# Altium schematic sheet Gate_Driver.SchDoc
size A4; SheetNumber: 2; SheetTotal: 9; SPICEModelCacheSDNXEFHK: <root> / <DocumentId>SDNXEFHK</DocumentId> / <CacheFrame Number="0"> / <Model Name="jmk325ac6107_m-p" Kind="CKT"> / <Text>* JMK325AC6107_M-P     SPICE MODEL  ( General Type ) / *-------------------------------------------------------------------------------------------------------- / * Model Generated by TAIYO YUDEN Corporation (http://www.ty-top.com) / * Version 1.0 / * TAIYO YUDEN Control No. 180521 / *-------------------------------------------------------------------------------------------------------- / * / * Products Name : Multilayer Ceramic Capacitors / * / * Characteristics : / *     Capacitance : 100 uF , Rated Voltage : 6.3V , TCC : X6S / *     Case Size : 3.2 x 2.5 / 0.126 x 0.098 [mm/inch] , Thickness : 2.5 / 0.098 [mm/inch] / *     (Conditions: Temperature = 25 degC , DC Bias Current/Voltage = 0A / 0V) / * / * Frequency Range : 0.0001MHz - 3000MHz / * / * External Node Assignments : / * / *  1  o---| |---o  2 / * / *-------------------------------------------------------------------------------------------------------- / .SubCkt JMK325AC6107_M-P 1 2 / **************************** / C0 1 110 84.041u / Cm 1 101 6.4542u / C1 101 102 23.925u / Rc1 101 102 26.91 / C2 102 103 22.738u / Rc2 102 103 11.611 / C3 103 110 14.771u / Rc3 103 110 1.1701 / C2m 1 301 2.8348u / C21 301 302 86.426u / Rc21 301 302 122.56 / C22 302 303 42.078u / Rc22 302 303 54.419 / C23 303 304 18.473u / Rc23 303 304 45.467 / C24 304 305 15.24u / Rc24 304 305 25.43 / C25 305 306 12.218u / Rc25 305 306 14.511 / C26 306 307 8.9602u / Rc26 306 307 7.3048 / C27 307 308 6.4396u / Rc27 307 308 4.0856 / C28 308 309 3.5418u / Rc28 308 309 2.2851 / C29 309 110 1.4287u / Rc29 309 110 1.8837 / Rp0 1 110 1Meg / L0 110 120 0.1837n / Lm 120 130 0.44285n / L1 120 121 0.3007n / RL1 121 130 0.18029 / L2 120 122 0.60464n / RL2 122 130 69.963m / L3 120 123 0.74938n / RL3 123 130 2.1757 / CR 120 124 19.095u / LR 124 125 0.53061n / RR 125 130 10.898m / CL 130 140 8.9181p / LL 130 140 0.18335n / RL 130 140 6.5197 / Rs 140 2 1.3136m / **************************** / .ends</Text> / </Model> / </CacheFrame> / </root>
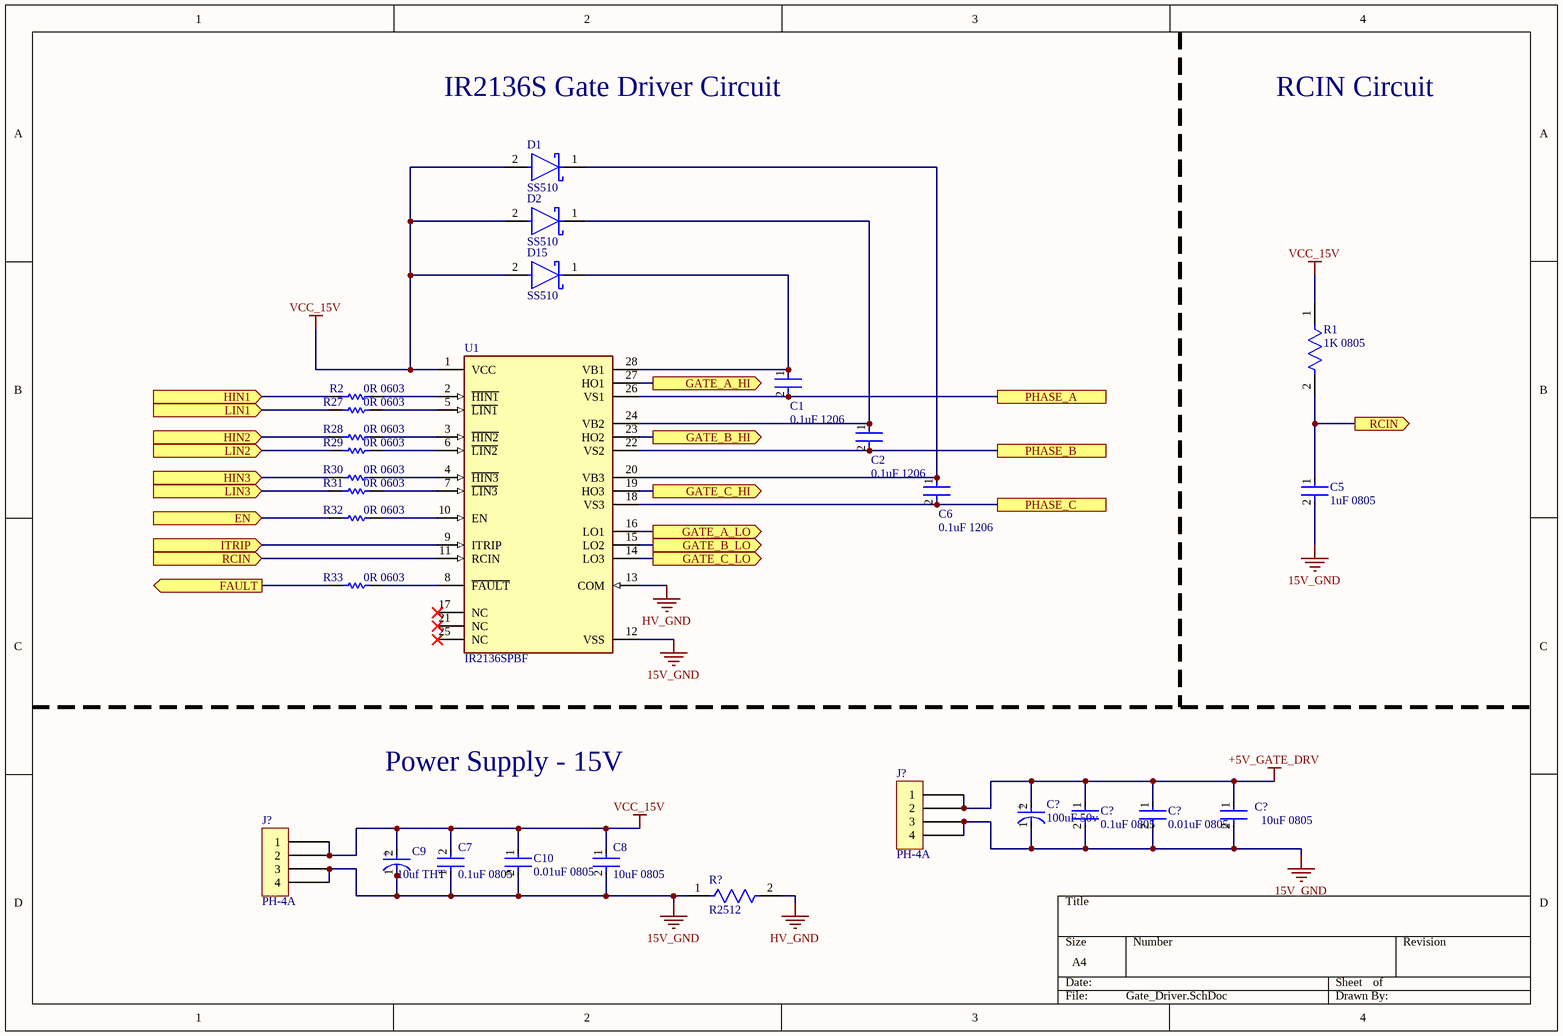
[diagram p0: Gate_Driver.SchDoc]

## Parts
(Parts that share a designator on the sheet are numbered #1, #2 ... from top to bottom, then left to right.)
C1  0.1uF 1206  [C1206]
C2  0.1uF 1206  [C1206]
C5  1uF 0805  [R0805]
C6  0.1uF 1206  [C1206]
C7  0.1uF 0805  [R0805]
C8  10uF 0805  [R0805]
C9  10uf THT  [FP-RAD-TH-D_10_0_5-L_20_2-MFG]
C10  0.01uF 0805  [R0805]
C?#1  100uF 50v  [FP-EEU-FR1H101B-MFG]
C?#2  0.1uF 0805  [R0805]
C?#3  0.01uF 0805  [R0805]
C?#4  10uF 0805  [R0805]
D1  SS510  [DO-210AA]
D2  SS510  [DO-210AA]
D15  SS510  [DO-210AA]
J?#1  PH-4A  [JST PH-4A]
J?#2  PH-4A  [JST PH-4A]
R1  1K 0805  [R0805]
R2  0R 0603  [R0603]
R27  0R 0603  [R0603]
R28  0R 0603  [R0603]
R29  0R 0603  [R0603]
R30  0R 0603  [R0603]
R31  0R 0603  [R0603]
R32  0R 0603  [R0603]
R33  0R 0603  [R0603]
R?  R2512  [R2512]
U1  IR2136SPBF  [FP-PG-DSO-28-IPC_C]

## Ports
EN (in), FAULT (out), GATE_A_HI (out), GATE_A_LO (out), GATE_B_HI (out), GATE_B_LO (out), GATE_C_HI (out), GATE_C_LO (out), HIN1 (in), HIN2 (in), HIN3 (in), ITRIP (in), LIN1 (in), LIN2 (in), LIN3 (in), PHASE_A, PHASE_B, PHASE_C, RCIN (in), RCIN (out)

## Nets
15V_GND: C5.2 C7.1 C8.2 C9.1(C) C10.2 C?#1.1(C) C?#2.2 C?#3.2 C?#4.2 J?#1.3 J?#1.4 J?#2.3 J?#2.4 R?.1 U1.12(VSS)
+5V_GATE_DRV: C?#1.2(A) C?#2.1 C?#3.1 C?#4.1 J?#1.1 J?#1.2
HV_GND: R?.2 U1.13(COM)
VCC_15V: C7.2 C8.1 C9.2(A) C10.1 D1.2(A) D2.2(A) D15.2(A) J?#2.1 J?#2.2 R1.1 U1.1(VCC)
EN: R32.1 ; port EN
FAULT: R33.1 ; port FAULT
GATE_A_HI: U1.27(HO1) ; port GATE_A_HI
GATE_A_LO: U1.16(LO1) ; port GATE_A_LO
GATE_B_HI: U1.23(HO2) ; port GATE_B_HI
GATE_B_LO: U1.15(LO2) ; port GATE_B_LO
GATE_C_HI: U1.19(HO3) ; port GATE_C_HI
GATE_C_LO: U1.14(LO3) ; port GATE_C_LO
HIN1: R2.1 ; port HIN1
HIN2: R28.1 ; port HIN2
HIN3: R30.1 ; port HIN3
ITRIP: U1.9(ITRIP) ; port ITRIP
LIN1: R27.1 ; port LIN1
LIN2: R29.1 ; port LIN2
LIN3: R31.1 ; port LIN3
PHASE_A: C1.2 U1.26(VS1) ; port PHASE_A
PHASE_B: C2.2 U1.22(VS2) ; port PHASE_B
PHASE_C: C6.2 U1.18(VS3) ; port PHASE_C
RCIN: C5.1 R1.2 U1.11(RCIN) ; port RCIN
NetC1_1: C1.1 D15.1(C) U1.28(VB1)
NetC2_1: C2.1 D2.1(C) U1.24(VB2)
NetC6_1: C6.1 D1.1(C) U1.20(VB3)
NetR2_2: R2.2 U1.2(~{HIN1})
NetR27_2: R27.2 U1.5(~{LIN1})
NetR28_2: R28.2 U1.3(~{HIN2})
NetR29_2: R29.2 U1.6(~{LIN2})
NetR30_2: R30.2 U1.4(~{HIN3})
NetR31_2: R31.2 U1.7(~{LIN3})
NetR32_2: R32.2 U1.10(EN)
NetR33_2: R33.2 U1.8(~{FAULT})

Not connected (* = marked no-connect by the designer): U1 17(NC)* 21(NC)* 25(NC)*

## Notes on the sheet
- IR2136S Gate Driver Circuit
- RCIN Circuit
- Power Supply - 15V
- (in symbol CMP-05427-000020-1) +
- (in symbol CMP-05427-000384-1) +

## Library data of the parts
C1 C2 C6 = 0.1uF 1206: 0.1uF/100nF 50V Capacitor ±10% Tolerance CC1206KRX7R9BB104 – 1206 Package; Price per piece: 2.22; Product URL: https://sharvielectronics.com/product/0-1uf-100nf-50v-capacitor-%c2%b110-tolerance-cc1206krx7r9bb104-1206-package/; Datasheet: https://sharvielectronics.com/wp-content/uploads/2020/09/Yageo-smd-Capacitor.pdf
C5 = 1uF 0805: 1uF/1000nF 50V Capacitor ±10% Tolerance CC0805KKX7R9BB105 – 0805 Package; Price per piece: 2.16; Product URL: https://sharvielectronics.com/product/1uf-1000nf-50v-capacitor-%c2%b110-tolerance-cc0805kkx7r9bb105-0805-package/; Datasheet: https://drive.google.com/file/d/1wr2K_YaGqgMtACeU2pC6RWLSxDMrIPxr/view?usp=sharing
C7 C?#2 = 0.1uF 0805: 0.1uF/100nF 100V Capacitor ±10% Tolerance CC0805KKX7R0BB104 – 0805 Package; Product URL: https://sharvielectronics.com/product/0-1uf-100nf-100v-capacitor-%c2%b110-tolerance-cc0805kkx7r0bb104-0805-package/; Price per piece: 4.76; Datasheet: https://drive.google.com/file/d/1wr2K_YaGqgMtACeU2pC6RWLSxDMrIPxr/view?usp=sharing
C8 C?#4 = 10uF 0805: 10uF/1000nF 50V Capacitor ±10% Tolerance CC0805KKX5R9BB106 – 0805 Package; Product URL: https://sharvielectronics.com/product/10uf-1000nf-50v-capacitor-%c2%b110-tolerance-cc0805kkx5r9bb106-0805-package/; Price per piece: 2.85; Datasheet: https://drive.google.com/file/d/1wr2K_YaGqgMtACeU2pC6RWLSxDMrIPxr/view?usp=sharing
C9 = CMP-05427-000384-1: Aluminum Electrolytic Capacitors (Radial Lead Type) 10uF ±20% 350V; Lead/Base Style: Straight; Lead Diameter: 0.6mm; Ripple Current (AC): 82mA; Life (Hours): 2000Hour; Series: NHG; Packaging: Bulk; Case/Package: Radial; Contact Plating: Tin; Voltage Rating: 350V; Tolerance: 20%; Termination: Radial; Lead Pitch: 5mm; Max Operating Temperature: 105°C; REACH SVHC: No SVHC; Height - Seated (Max): 0.866inch; Radiation Hardening: No; Voltage Rating (DC): 350V; Diameter: 10mm; Length: 20mm; Mount: Through Hole; Package Quantity: 200; Min Operating Temperature: -25°C; Construction: RADIAL; Ripple Current: 82mA; Height: 20mm; Capacitance: 10uF; RoHS Compliant: Yes; Price per piece: 2.25; Product URL: https://sharvielectronics.com/product/10uf-35v-electrolytic-capacitor-105c-5x11mm-samwha/; Datasheet: https://drive.google.com/file/d/1s8SUY3P6K0bBIcG8WC2zo0Wz7jUZ4bD_/view?usp=sharing
C10 C?#3 = 0.01uF 0805: 10nF/0.01uF 50V Capacitor ±10% Tolerance 0805B103K500CT – 0805 Package; Product URL: https://sharvielectronics.com/product/10nf-0-01uf-50v-capacitor-%c2%b110-tolerance-0805b103k500ct-0805-package/; Price per piece: 2.45; Datasheet: https://drive.google.com/file/d/18RHnvRuuuVekgJyOA4l8O3UUaSpuKbHR/view?usp=sharing
C?#1 = CMP-05427-000020-1: 100uF 50V Electrolytic Capacitor – JWCO; Tolerance: 20%; Life (Hours): 6000Hour; Ripple Current: 870mA; Lead Diameter: 0.6mm; Impedance: 61mR; Mount: Through Hole; Lead Free: Lead Free; Length: 11.5mm; Height - Seated (Max): 0.512inch; Contact Plating: Tin; Termination: Radial; Series: FR; Max Operating Temperature: 105°C; Features: General Purpose; Min Operating Temperature: -40°C; RoHS Compliant: Yes; Height: 11.5mm; Voltage Rating (DC): 50V; Diameter: 8mm; Capacitance: 100uF; Lead Pitch: 5mm; Radiation Hardening: No; Package Quantity: 1; Case/Package: Radial; Voltage Rating: 50V; Packaging: Tape and Reel; ESR (Equivalent Series Resistance): 61mR; REACH SVHC: No SVHC; Price per piece: 4.75; Product URL: https://sharvielectronics.com/product/100uf-50v-electrolytic-capacitor-jwco/; Datasheet: https://drive.google.com/file/d/1y5PJPaMvWZ3P4wiieSg8-_Hf04MAZeNc/view?usp=sharing
D1 D2 D15 = SS510: SS510-E3/52T – 100V 5A High Voltage Schottky Diode – DO-214AA Package; Product URL: https://sharvielectronics.com/product/ss510-e3-52t-100v-5a-high-voltage-schottky-diode-do-214aa-package/; Datasheet: https://drive.google.com/file/d/1iz5AYn44Er0kaCDKeIane-7fZ44xILG8/view?usp=sharing; Price per piece: 12.75
J?#1 J?#2 = 4 Pin JST PH-4A: 4 Pin JST PH-4A Straight Male Connector – 2mm Pitch; Price per piece: 3.55; Product URL: https://sharvielectronics.com/product/4-pin-jst-ph-4a-straight-male-connector-2mm-pitch/; Datasheet: https://drive.google.com/file/d/1xtnH8dmm313gQd5L_EWqAXCnKwT4okMA/view?usp=sharing
R1 = 1k 0805: 1K Ohm 1/8 Watt Resistor 1% Tolerance 0805S8F1001T5E – 0805 Package; Price per piece: 0.82; Product URL: https://sharvielectronics.com/product/1k-ohm-1-8-watt-resistor-1-tolerance-0805s8f1001t5e-0805-package/; Datasheet: https://drive.google.com/file/d/1rtx85iFJaMrDbsv7PAzG9bTFItPmAE38/view?usp=sharing
R2 R27-R33 = R0000 0603: 0 Ohm 1/10 Watt Resistor 1% Tolerance RC0603FR-070RL – 0603 Package; Price per piece: 0.97; Product URL: https://sharvielectronics.com/product/0-ohm-1-10-watt-resistor-1-tolerance-rc0603fr-070rl-0603-package/; Datasheet: https://drive.google.com/file/d/1pkLQT_RQ1i35oFQcGREpZr7Oy3Ppi-ZT/view?usp=sharing
R? = 1K_2512: 1K Ohm 1W Resistor 2512 Package; Manufacturer: Vishay Dale; Manufacturer Part Number: CRCW25121R00FKEG; Resistance: 1R; Tolerance: 1%; Voltage Rating: 500V; Temperature Coefficient: 100ppm/°C; Prie per piece: 3.25; Number of Terminations: 2; Packaging: Tape and Reel; Features: Automotive AEC-Q200; Military Standard: Not; Power Rating: 1W; Max Operating Temperature: 155°C; Number of Pins: 2; Radiation Hardening: No; Mount: Surface Mount; Height: 0.6mm; Max Power Dissipation: 1W; Case Code (Metric): 6432; Termination: SMD/SMT; REACH SVHC: No SVHC; Case/Package: 2512; Weight: 0.001429oz; Package Quantity: 2000; Composition: Thick Film; Voltage Rating (DC): 500V; Width: 0.124inch; Length: 6.3mm; Lead Free: Lead Free; Min Operating Temperature: -55°C; Contact Plating: Tin; Case Code (Imperial): 2512; Depth: 3.15mm; Price per piece: 3.25; ComponentLink1Description: Product URL; ComponentLink1URL: https://sharvielectronics.com/product/1k-ohm-1w-resistor-2512-package-pack-of-5/; ComponentLink2Description: Datasheet; ComponentLink2URL: *; Product URL: https://sharvielectronics.com/product/1k-ohm-1w-resistor-2512-package-pack-of-5/; Datasheet: *
U1 = CMP-32851-000132-1: IC GATE DRVR HALF-BRIDGE 28SOIC; Fall Time: 75ns; Max Supply Voltage: 20V; On-State Resistance: 100R; Output Voltage: 620V; Number of Drivers: 6; Max Output Current: 350mA; Propagation Delay: 425ns; Channel Type: 3-Phase; Min Supply Voltage: 10V; Halogen Free: Halogen Free; Height: 0.093inch; REACH SVHC: No SVHC; RoHS Compliant: Yes; Case/Package: SOIC; Number of Channels: 6; Lead Free: Lead Free; Output Current: 350mA; Number of Outputs: 6; Mount: Surface Mount; Packaging: Rail/Tube; Min Operating Temperature: -40°C; Package Quantity: 25; Series: -; Max Operating Temperature: 150°C; Width: 0.299inch; Length: 0.712inch; Number of Pins: 28; Price per piece: 365; ComponentLink1Description: New link; ComponentLink1URL: *; Product URL: https://sharvielectronics.com/product/ir2136-3-phase-bridge-driver/